# Altium schematic sheet image_reject.SchDoc
size 297 x 209 mm
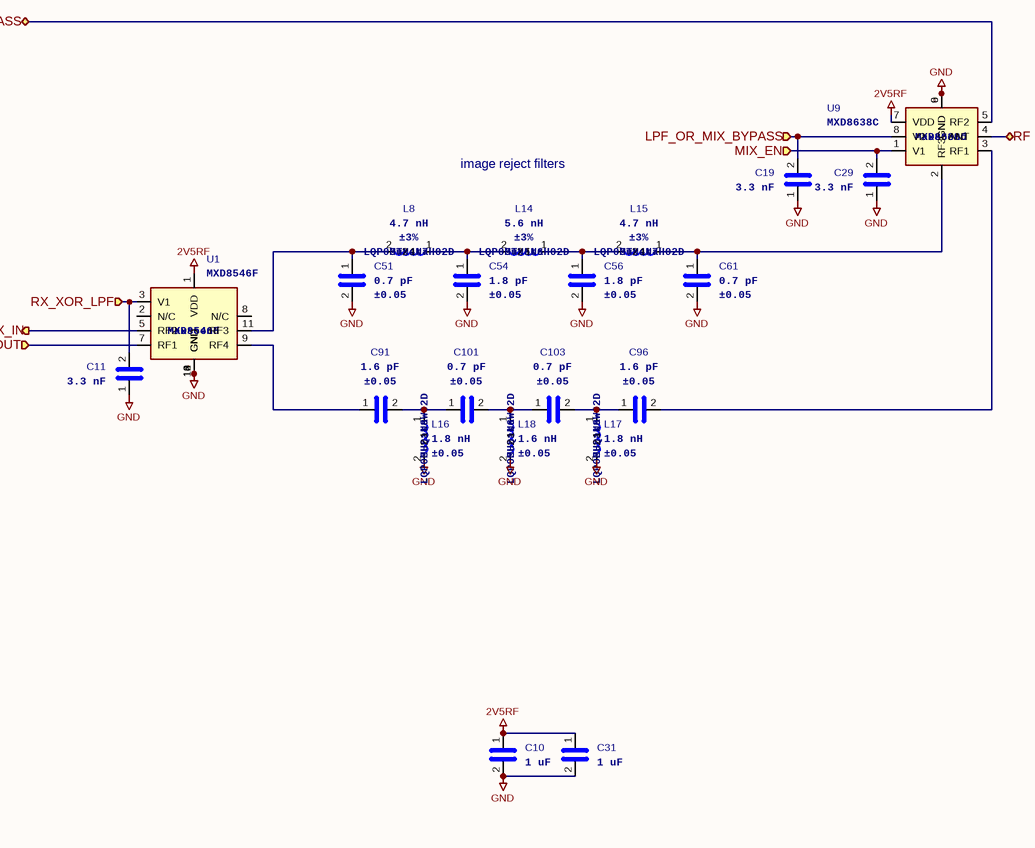
[diagram p0: image_reject.SchDoc]

## Parts
C10  1 uF  [C_0201_0603Metric]
C11  3.3 nF  [C_0201_0603Metric]
C19  3.3 nF  [C_0201_0603Metric]
C29  3.3 nF  [C_0201_0603Metric]
C31  1 uF  [C_0201_0603Metric]
C51  Tolerance: ±0.05  [C_0201_0603Metric]  (hidden comment: 0.7 pF)
C54  Tolerance: ±0.05  [C_0201_0603Metric]  (hidden comment: 1.8 pF)
C56  Tolerance: ±0.05  [C_0201_0603Metric]  (hidden comment: 1.8 pF)
C61  Tolerance: ±0.05  [C_0201_0603Metric]  (hidden comment: 0.7 pF)
C91  Tolerance: ±0.05  [C_0201_0603Metric]  (hidden comment: 1.6 pF)
C96  Tolerance: ±0.05  [C_0201_0603Metric]  (hidden comment: 1.6 pF)
C101  Tolerance: ±0.05  [C_0201_0603Metric]  (hidden comment: 0.7 pF)
C103  Tolerance: ±0.05  [C_0201_0603Metric]  (hidden comment: 0.7 pF)
L8  Manufacturer: Murata  Part Number: LQP03TN4N7H02D  Tolerance: ±3%  [L_0201_0603Metric]  (hidden comment: 4.7 nH)
L14  Manufacturer: Murata  Part Number: LQP03TN5N6H02D  Tolerance: ±3%  [L_0201_0603Metric]  (hidden comment: 5.6 nH)
L15  Manufacturer: Murata  Part Number: LQP03TN4N7H02D  Tolerance: ±3%  [L_0201_0603Metric]  (hidden comment: 4.7 nH)
L16  Manufacturer: Murata  Part Number: LQP03HQ1N8W02D  Tolerance: ±0.05  [L_0201_0603Metric]  (hidden comment: 1.8 nH)
L17  Manufacturer: Murata  Part Number: LQP03HQ1N8W02D  Tolerance: ±0.05  [L_0201_0603Metric]  (hidden comment: 1.8 nH)
L18  Manufacturer: Murata  Part Number: LQP03HQ1N6W02D  Tolerance: ±0.05  [L_0201_0603Metric]  (hidden comment: 1.6 nH)
U1  Manufacturer: Maxscend  [QFN-12-1EP_2x2mm_P0.5mm_EP1x1mm]  (hidden comment: MXD8546F)
U9  Manufacturer: Maxscend  [MXD8638C]  (hidden comment: MXD8638C)

## Ports
LPF_OR_MIX_BYPASS (in), MIX_BYPASS (bidir), MIX_EN (in), RF (bidir), RX_MIX_IN (out), RX_XOR_LPF (in), TX_MIX_OUT (in)

## Nets
2V5RF: C10.1 C31.1 U1.1(VDD) U9.7(VDD)
GND: C10.2 C11.1 C19.1 C29.1 C31.2 C51.2 C54.2 C56.2 C61.2 L16.2 L17.2 L18.2 U1.4(GND) U1.6(GND) U1.10(GND) U1.12(GND) U1.13(GND) U9.6(GND) U9.9(GND)
LPF_OR_MIX_BYPASS: C19.2 U9.8(V2) ; port LPF_OR_MIX_BYPASS
MIX_BYPASS: U9.5(RF2) ; port MIX_BYPASS
MIX_EN: C29.2 U9.1(V1) ; port MIX_EN
RF: U9.4(ANT) ; port RF
RX_MIX_IN: U1.5(RF2) ; port RX_MIX_IN
RX_XOR_LPF: C11.2 U1.3(V1) ; port RX_XOR_LPF
TX_MIX_OUT: U1.7(RF1) ; port TX_MIX_OUT
NetC51_1: C51.1 L8.2 U1.11(RF3)
NetC54_1: C54.1 L8.1 L14.2
NetC56_1: C56.1 L14.1 L15.2
NetC61_1: C61.1 L15.1 U9.2(RF3)
NetC91_1: C91.1 U1.9(RF4)
NetC91_2: C91.2 C101.1 L16.1
NetC96_1: C96.1 C103.2 L17.1
NetC96_2: C96.2 U9.3(RF1)
NetC101_2: C101.2 C103.1 L18.1

Not connected (* = marked no-connect by the designer): U1 2(N/C) 8(N/C)

## Notes on the sheet
- image reject filters
- 1
- 2
- 3
- 4
- 5
- 6
- A
- B
- C
- ${LICENSE}
- D
- Title: ${TITLE}
- File: image_reject.kicad_sch
- Sheet: /
- ${COPYRIGHT}
- KiCad E.D.A.  kicad (5.1.4)-1
- Size: A4
- Date: ${DATE}
- Rev: ${VERSION}
- Id: 1/1

## Library data of the parts
C10 C31 = C: Manufacturer: Murata; Part Number: GRM033R61A105ME44D; Substitution: GRM033R61A105ME44*, GRM033R61C105ME15*, Samsung CL03A105MO3NRN*; Value: 1 uF; Footprint: Capacitor_SMD:C_0201_0603Metric
C11 C19 C29 = C: Manufacturer: Murata; Part Number: GRM033R71A332KA01D; Substitution: GRM033R71A332K*; Value: 3.3 nF; Footprint: Capacitor_SMD:C_0201_0603Metric
C51 C61 C101 C103 = C: Manufacturer: Murata; Part Number: GRM0335C1ER70WA01D; Substitution: GRM0335C1HR70W*, GRM0335C1ER70W*; Value: 0.7 pF; Footprint: Capacitor_SMD:C_0201_0603Metric
C54 C56 = C: Manufacturer: Murata; Part Number: GRM0335C1E1R8WA01D; Substitution: GRM0335C1H1R8W*, GRM0335C1E1R8W*; Value: 1.8 pF; Footprint: Capacitor_SMD:C_0201_0603Metric
C91 C96 = C: Manufacturer: Murata; Part Number: GRM0335C1E1R6WA01D; Substitution: GRM0335C1H1R6W*, GRM0335C1E1R6W*; Value: 1.6 pF; Footprint: Capacitor_SMD:C_0201_0603Metric
L8 L14-L18 = L: Footprint: Inductor_SMD:L_0201_0603Metric
  L8 L15: Value: 4.7 nH
  L14: Value: 5.6 nH
  L16 L17: Value: 1.8 nH
  L18: Value: 1.6 nH
U9 = MXD8638: Part Number: MXD8638C; Value: MXD8638C; Footprint: praline:MXD8638C
U1 = MXD8546F: Part Number: MXD8546F; Value: MXD8546F; Footprint: praline:QFN-12-1EP_2x2mm_P0.5mm_EP1x1mm